# EAGLE design PWR1 (EAGLE 4.16)
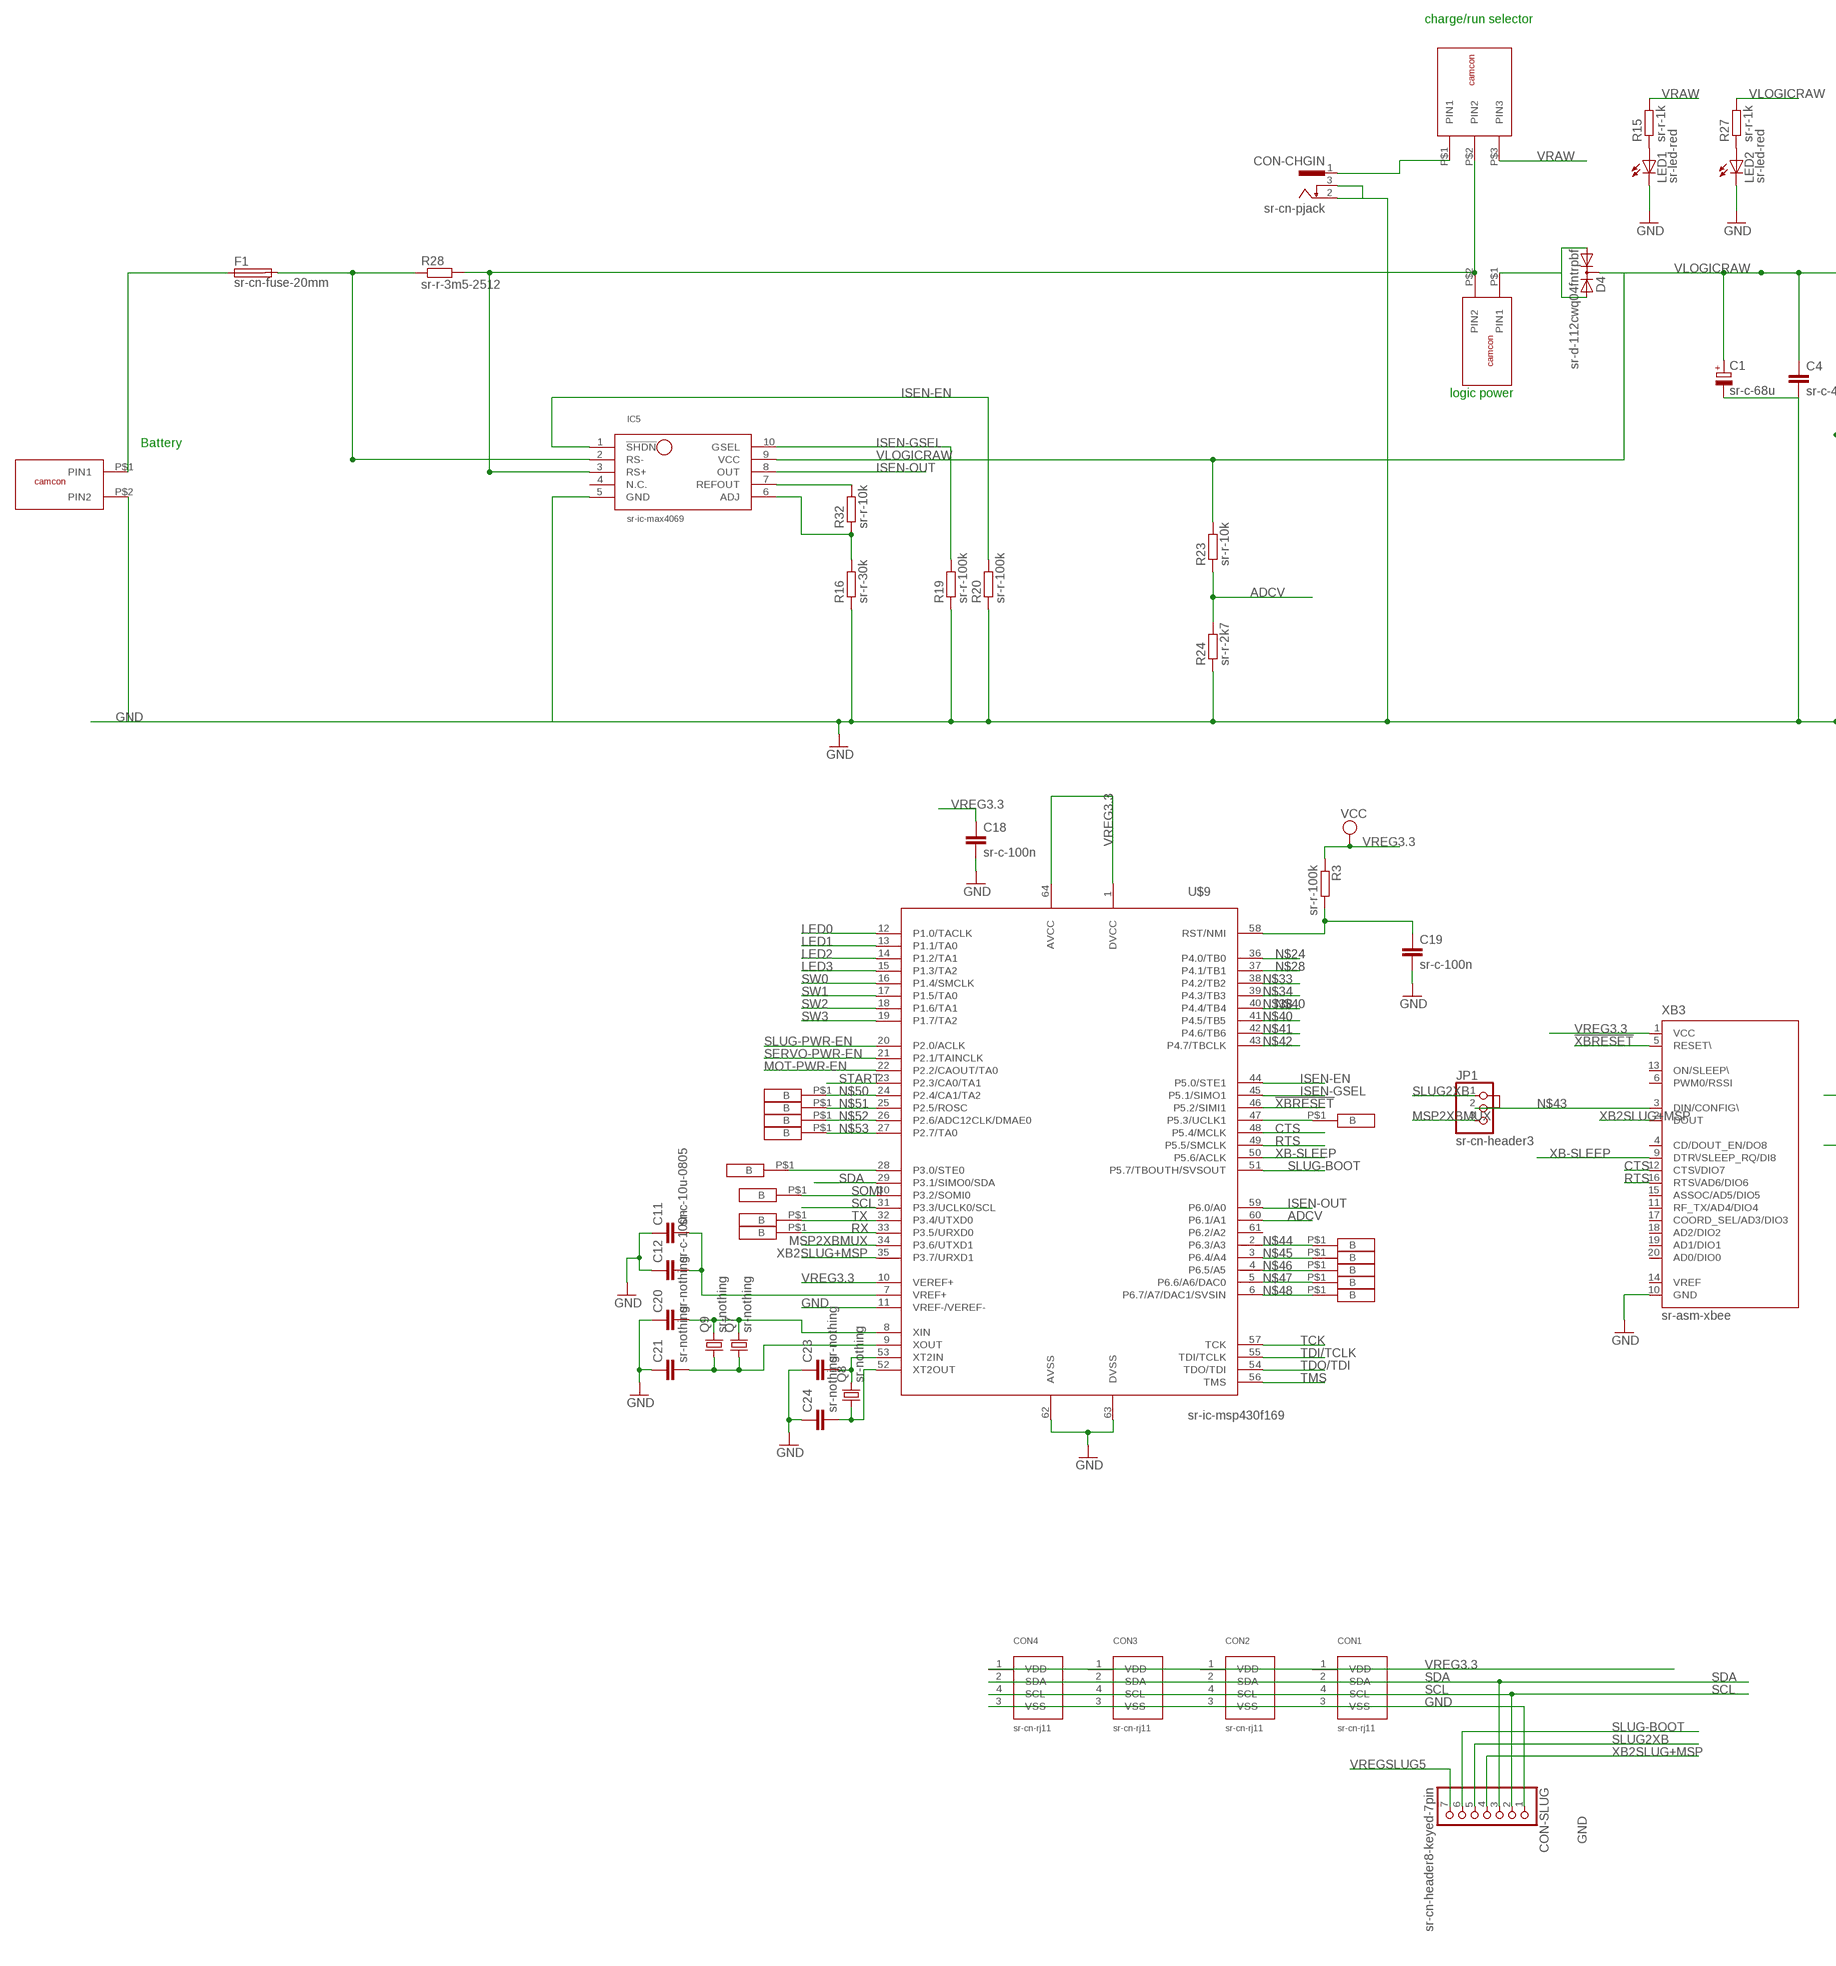
[diagram p0: schematic, sheet 1, part 1 of 2]
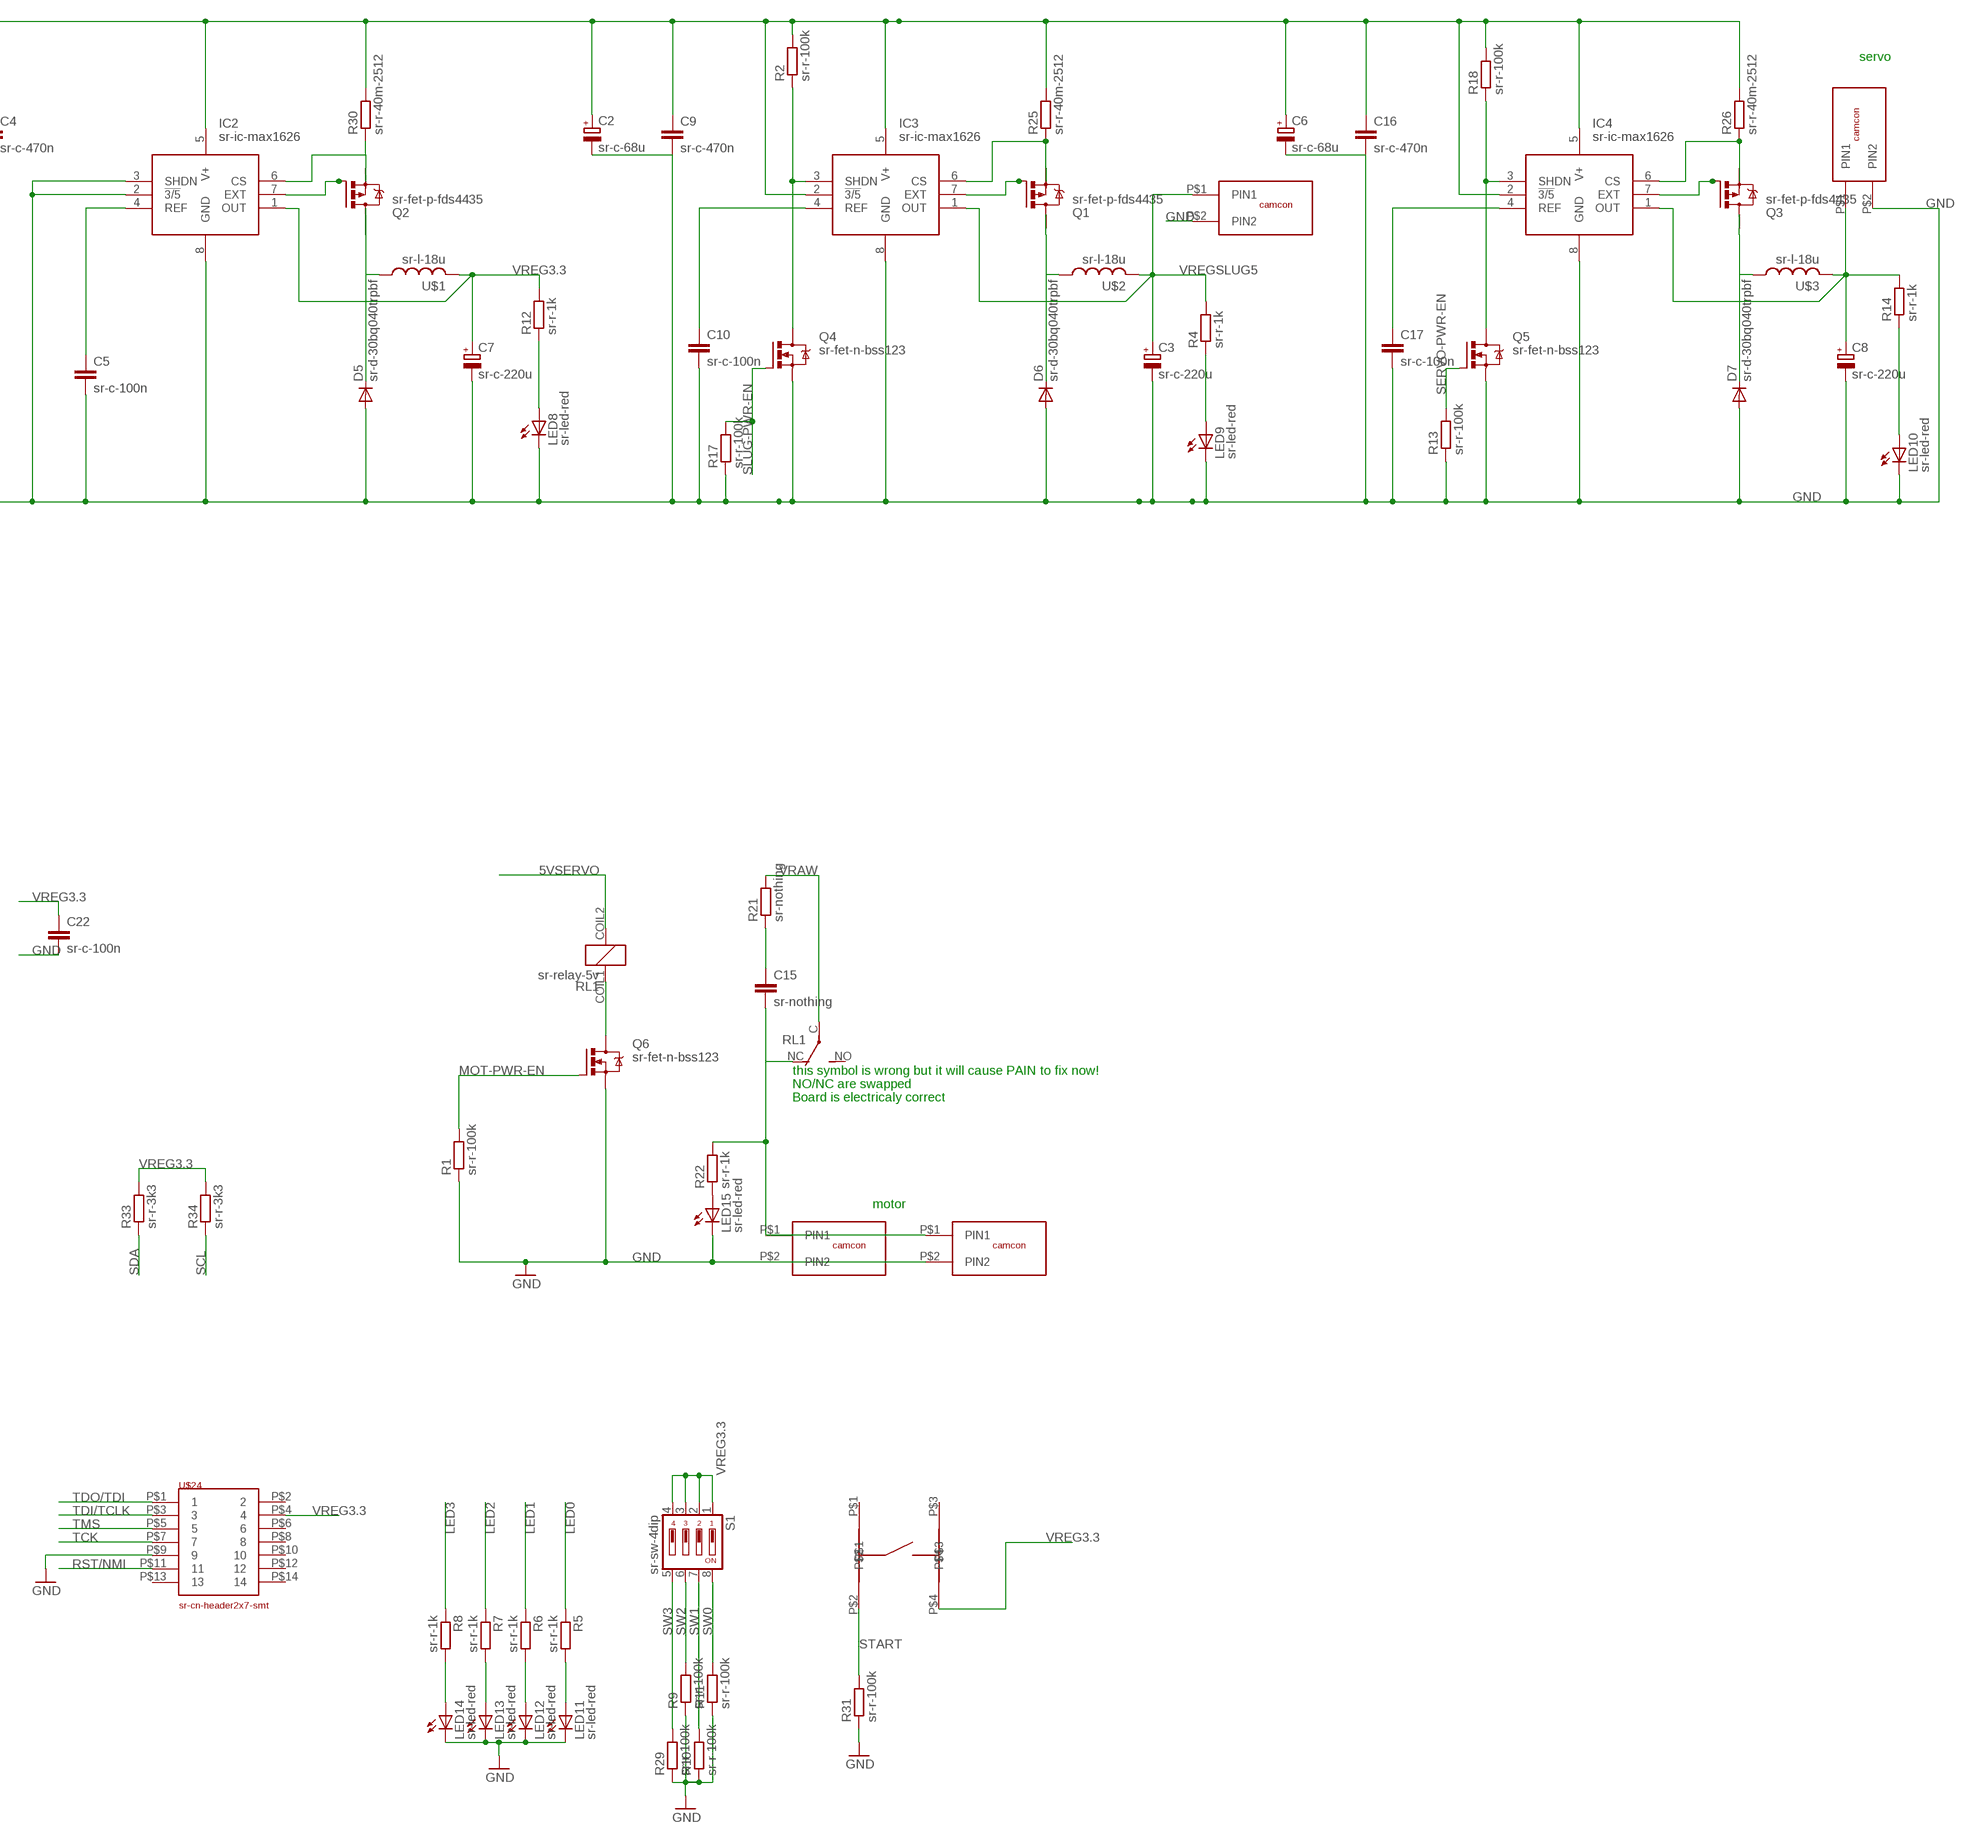
[diagram p1: schematic, sheet 1, part 2 of 2]

## Parts
C1  sr-c-68u  CPOL-EUE  [PANASONIC_E]
C2  sr-c-68u  CPOL-EUE  [PANASONIC_E]
C3  sr-c-220u  CPOL-EUE  [PANASONIC_E]
C4  sr-c-470n  C-EUC0603  [C0603]
C5  sr-c-100n  C-EUC0603  [C0603]
C6  sr-c-68u  CPOL-EUE  [PANASONIC_E]
C7  sr-c-220u  CPOL-EUE  [PANASONIC_E]
C8  sr-c-220u  CPOL-EUE  [PANASONIC_E]
C9  sr-c-470n  C-EUC0603  [C0603]
C10  sr-c-100n  C-EUC0603  [C0603]
C11  sr-c-10u-0805  C-EUC0805  [C0805]
C12  sr-c-100n  C-EUC0603  [C0603]
C15  sr-nothing  C-EUC0603  [C0603]
C16  sr-c-470n  C-EUC0603  [C0603]
C17  sr-c-100n  C-EUC0603  [C0603]
C18  sr-c-100n  C-EUC0603  [C0603]
C19  sr-c-100n  C-EUC0603  [C0603]
C20  sr-nothing  C-EUC0603  [C0603]
C21  sr-nothing  C-EUC0603  [C0603]
C22  sr-c-100n  C-EUC0603  [C0603]
C23  sr-nothing  C-EUC0603  [C0603]
C24  sr-nothing  C-EUC0603  [C0603]
CON1  sr-cn-rj11  MODULE_CON  [RJ11-4P4C]
CON2  sr-cn-rj11  MODULE_CON  [RJ11-4P4C]
CON3  sr-cn-rj11  MODULE_CON  [RJ11-4P4C]
CON4  sr-cn-rj11  MODULE_CON  [RJ11-4P4C]
CON-CHGIN  sr-cn-pjack  SCD-014A  [SCD-014-A]
CON-SLUG  sr-cn-header8-keyed-7pin  PINHD-1X7  [1X07]
D4  sr-d-112cwq04fntrpbf  FFB20UP20DN-DIODE  [TO252-3]
D5  sr-d-30bq040trpbf  DIODE-SMC  [SMC]
D6  sr-d-30bq040trpbf  DIODE-SMC  [SMC]
D7  sr-d-30bq040trpbf  DIODE-SMC  [SMC]
F1  sr-cn-fuse-20mm  SH22,5  [SH22,5]
IC2  sr-ic-max1626  MAX1626ESA+  [SO04]
IC3  sr-ic-max1626  MAX1626ESA+  [SO04]
IC4  sr-ic-max1626  MAX1626ESA+  [SO04]
IC5  sr-ic-max4069  MAX4069  [UMAX]
JP1  sr-cn-header3  PINHD-1X3  [1X03]
LED1  sr-led-red  LEDCHIP-LED0603  [CHIP-LED0603]
LED2  sr-led-red  LEDCHIP-LED0603  [CHIP-LED0603]
LED8  sr-led-red  LEDCHIP-LED0603  [CHIP-LED0603]
LED9  sr-led-red  LEDCHIP-LED0603  [CHIP-LED0603]
LED10  sr-led-red  LEDCHIP-LED0603  [CHIP-LED0603]
LED11  sr-led-red  LEDCHIP-LED0603  [CHIP-LED0603]
LED12  sr-led-red  LEDCHIP-LED0603  [CHIP-LED0603]
LED13  sr-led-red  LEDCHIP-LED0603  [CHIP-LED0603]
LED14  sr-led-red  LEDCHIP-LED0603  [CHIP-LED0603]
LED15  sr-led-red  LEDCHIP-LED0603  [CHIP-LED0603]
Q1  sr-fet-p-fds4435  P-MOSFET-SO8  [SO-08]
Q2  sr-fet-p-fds4435  P-MOSFET-SO8  [SO-08]
Q3  sr-fet-p-fds4435  P-MOSFET-SO8  [SO-08]
Q4  sr-fet-n-bss123  2N7002  [SOT23]
Q5  sr-fet-n-bss123  2N7002  [SOT23]
Q6  sr-fet-n-bss123  2N7002  [SOT23]
Q7  sr-nothing  CRYSTALSM49  [SM49]
Q8  sr-nothing  CRYSTALSM49  [SM49]
Q9  sr-nothing  CRYSTALTC26H  [TC26H]
R1  sr-r-100k  R-EU_R0603  [R0603]
R2  sr-r-100k  R-EU_R0603  [R0603]
R3  sr-r-100k  R-EU_R0603  [R0603]
R4  sr-r-1k  R-EU_R0603  [R0603]
R5  sr-r-1k  R-EU_R0603  [R0603]
R6  sr-r-1k  R-EU_R0603  [R0603]
R7  sr-r-1k  R-EU_R0603  [R0603]
R8  sr-r-1k  R-EU_R0603  [R0603]
R9  sr-r-100k  R-EU_R0603  [R0603]
R10  sr-r-100k  R-EU_R0603  [R0603]
R11  sr-r-100k  R-EU_R0603  [R0603]
R12  sr-r-1k  R-EU_R0603  [R0603]
R13  sr-r-100k  R-EU_R0603  [R0603]
R14  sr-r-1k  R-EU_R0603  [R0603]
R15  sr-r-1k  R-EU_R0603  [R0603]
R16  sr-r-30k  R-EU_R0603  [R0603]
R17  sr-r-100k  R-EU_R0603  [R0603]
R18  sr-r-100k  R-EU_R0603  [R0603]
R19  sr-r-100k  R-EU_R0603  [R0603]
R20  sr-r-100k  R-EU_R0603  [R0603]
R21  sr-nothing  R-EU_R0603  [R0603]
R22  sr-r-1k  R-EU_R0603  [R0603]
R23  sr-r-10k  R-EU_R0603  [R0603]
R24  sr-r-2k7  R-EU_R0603  [R0603]
R25  sr-r-40m-2512  R-EU_R2512  [R2512]
R26  sr-r-40m-2512  R-EU_R2512  [R2512]
R27  sr-r-1k  R-EU_R0603  [R0603]
R28  sr-r-3m5-2512  R-EU_R2512  [R2512]
R29  sr-r-100k  R-EU_R0603  [R0603]
R30  sr-r-40m-2512  R-EU_R2512  [R2512]
R31  sr-r-100k  R-EU_R0603  [R0603]
R32  sr-r-10k  R-EU_R0603  [R0603]
R33  sr-r-3k3  R-EU_R0603  [R0603]
R34  sr-r-3k3  R-EU_R0603  [R0603]
RL1  sr-relay-5v  SRM-1C-SL-5VDCRELAY  [RELAY5PIN]
S1  sr-sw-4dip  DP04  [DP-04]
U$1  sr-l-18u  09INDUCTOR  [09INDUCTIR]
U$2  sr-l-18u  09INDUCTOR  [09INDUCTIR]
U$3  sr-l-18u  09INDUCTOR  [09INDUCTIR]
U$4  sr-cn-camcon3w  CAMCON3W  [09CON3W]
U$5  sr-cn-camcon2w  CAMCON2W  [09CON2W]
U$6  sr-cn-camcon2w  CAMCON2W  [09CON2W]
U$7  sr-cn-camcon2w  CAMCON2W  [09CON2W]
U$8  sr-cn-camcon2w  CAMCON2W  [09CON2W]
U$9  sr-ic-msp430f169  MSP430F169  [LQFP-64]
U$10  sr-sw-button  09SWITCH  [09SW]
U$11  sr-cn-camcon2w  CAMCON2W  [09CON2W]
U$13  sr-nothing  BODGEPLATE1  [BODGEPLATE]
U$14  sr-nothing  BODGEPLATE1  [BODGEPLATE]
U$16  sr-nothing  BODGEPLATE1  [BODGEPLATE]
U$17  sr-nothing  BODGEPLATE1  [BODGEPLATE]
U$24  sr-cn-header2x7-smt  SMT2X7  [SMT2X7]
U$27  sr-nothing  BODGEPLATE1  [BODGEPLATE]
U$28  sr-nothing  BODGEPLATE1  [BODGEPLATE]
U$29  sr-nothing  BODGEPLATE1  [BODGEPLATE]
U$30  sr-nothing  BODGEPLATE1  [BODGEPLATE]
U$31  sr-nothing  BODGEPLATE1  [BODGEPLATE]
U$32  sr-nothing  BODGEPLATE1  [BODGEPLATE]
U$37  sr-nothing  BODGEPLATE1  [BODGEPLATE]
U$38  sr-nothing  BODGEPLATE1  [BODGEPLATE]
U$39  sr-nothing  BODGEPLATE1  [BODGEPLATE]
U$40  sr-nothing  BODGEPLATE1  [BODGEPLATE]
USBPOWER  sr-cn-camcon2w  CAMCON2W  [09CON2W]
XB3  sr-asm-xbee  XBEE  [XBEE]

## Nets
5VSERVO: C8.+ IC4.1(OUT) R14.2 RL1.COIL2 U$3.P$2 U$7.P$1(PIN1)
!XBRESET: U$9.46(P5.2/SIMI1) XB3.5(RESET\)
ADCV: R23.1 R24.2 U$9.60(P6.1/A1)
CTS: U$9.48(P5.4/MCLK) XB3.12(CTS\/DIO7)
GND: C1.- C2.- C3.- C4.2 C5.2 C6.- C7.- C8.- C9.2 C10.2 C11.1 C12.1 C16.2 C17.2 C18.2 C19.2 C20.1 C21.1 C22.2 C23.1 C24.1 CON1.3(VSS) CON2.3(VSS) CON3.3(VSS) CON4.3(VSS) CON-CHGIN.2 CON-CHGIN.3 CON-SLUG.1 D5.A D6.A D7.A IC2.2(!3/5) IC2.3(SHDN) IC2.8(GND) IC3.8(GND) IC4.8(GND) IC5.5(GND) LED1.C LED2.C LED8.C LED9.C LED10.C LED11.C LED12.C LED13.C LED14.C LED15.C Q4.2(S) Q5.2(S) Q6.2(S) R1.1 R9.1 R10.1 R11.1 R13.1 R16.1 R17.1 R19.1 R20.1 R24.1 R29.1 R31.1 U$5.P$2(PIN2) U$7.P$2(PIN2) U$8.P$2(PIN2) U$9.11(VREF-/VEREF-) U$9.62(AVSS) U$9.63(DVSS) U$11.P$2(PIN2) U$24.P$9 USBPOWER.P$2(PIN2) XB3.10(GND)
ISEN-EN: IC5.1(!SHDN) R20.2 U$9.44(P5.0/STE1)
ISEN-GSEL: IC5.10(GSEL) R19.2 U$9.45(P5.1/SIMO1)
ISEN-OUT: IC5.8(OUT) U$9.59(P6.0/A0)
L2: D7.C Q3.5(D) Q3.6(D) Q3.7(D) Q3.8(D) U$3.P$1
LED0: R5.1 U$9.12(P1.0/TACLK)
LED1: R6.1 U$9.13(P1.1/TA0)
LED2: R7.1 U$9.14(P1.2/TA1)
LED3: R8.1 U$9.15(P1.3/TA2)
MOT-PWR-EN: Q6.1(G) R1.2 U$9.22(P2.2/CAOUT/TA0)
MSP2XBMUX: JP1.3 U$9.34(P3.6/UTXD1)
N$1: LED11.A R5.2
N$2: IC5.3(RS+) R28.2 U$4.P$2(PIN2) U$6.P$2(PIN2)
N$3: Q6.3(D) RL1.COIL1
N$4: LED12.A R6.2
N$5: IC2.6(CS) Q2.1(S) Q2.2(S) Q2.3(S) R30.1
N$6: C5.1 IC2.4(REF)
N$7: C15.1 R21.1
N$8: C17.1 IC4.4(REF)
N$9: C20.2 Q7.2 Q9.2 U$9.8(XIN)
N$10: IC2.7(EXT) Q2.4(G)
N$11: IC4.6(CS) Q3.1(S) Q3.2(S) Q3.3(S) R26.1
N$12: C10.1 IC3.4(REF)
N$13: IC3.6(CS) Q1.1(S) Q1.2(S) Q1.3(S) R25.1
N$14: D4.GATE(A1) D4.SOURCE(A2) U$6.P$1(PIN1)
N$15: IC3.7(EXT) Q1.4(G)
N$16: LED13.A R7.2
N$17: C15.2 R22.2 RL1.NC U$8.P$1(PIN1) U$11.P$1(PIN1)
N$18: C21.2 Q7.1 Q9.1 U$9.9(XOUT)
N$19: C23.2 Q8.2 U$9.53(XT2IN)
N$20: IC4.7(EXT) Q3.4(G)
N$21: LED14.A R8.2
N$22: D5.C Q2.5(D) Q2.6(D) Q2.7(D) Q2.8(D) U$1.P$1
N$23: D6.C Q1.5(D) Q1.6(D) Q1.7(D) Q1.8(D) U$2.P$1
N$24: U$9.36(P4.0/TB0)
N$25: LED15.A R22.1
N$26: C11.2 C12.2 U$9.7(VREF+)
N$27: LED1.A R15.1
N$28: U$9.37(P4.1/TB1)
N$29: IC3.3(SHDN) Q4.3(D) R2.1
N$30: LED8.A R12.1
N$31: LED9.A R4.1
N$33: U$9.38(P4.2/TB2)
N$34: U$9.39(P4.3/TB3)
N$35: F1.1 U$5.P$1(PIN1)
N$36: IC4.3(SHDN) Q5.3(D) R18.1
N$37: LED10.A R14.1
N$38: U$9.40(P4.4/TB4)
N$39: F1.2 IC5.2(RS-) R28.1
N$40: U$9.41(P4.5/TB5)
N$41: U$9.42(P4.6/TB6)
N$42: U$9.43(P4.7/TBCLK)
N$43: JP1.2 XB3.3(DIN/CONFIG\)
N$44: U$9.2(P6.3/A3) U$32.P$1(B)
N$45: U$9.3(P6.4/A4) U$31.P$1(B)
N$46: U$9.4(P6.5/A5) U$30.P$1(B)
N$47: U$9.5(P6.6/A6/DAC0) U$29.P$1(B)
N$48: U$9.6(P6.7/A7/DAC1/SVSIN) U$28.P$1(B)
N$49: U$9.28(P3.0/STE0) U$13.P$1(B)
N$50: U$9.24(P2.4/CA1/TA2) U$37.P$1(B)
N$51: U$9.25(P2.5/ROSC) U$38.P$1(B)
N$52: U$9.26(P2.6/ADC12CLK/DMAE0) U$39.P$1(B)
N$53: U$9.27(P2.7/TA0) U$40.P$1(B)
N$54: CON-CHGIN.1 U$4.P$1(PIN1)
N$55: U$9.47(P5.3/UCLK1) U$27.P$1(B)
N$56: IC5.7(REFOUT) R32.2
N$58: IC5.6(ADJ) R16.2 R32.1
N$68: LED2.A R27.1
N$70: C24.2 Q8.1 U$9.52(XT2OUT)
RST/NMI: C19.1 R3.2 U$9.58(RST/NMI) U$24.P$11
RTS: U$9.49(P5.5/SMCLK) XB3.16(RTS\/AD6/DIO6)
RX: U$9.33(P3.5/URXD0) U$17.P$1(B)
SCL: CON1.4(SCL) CON2.4(SCL) CON3.4(SCL) CON4.4(SCL) CON-SLUG.2 R34.1 U$9.31(P3.3/UCLK0/SCL)
SDA: CON1.2(SDA) CON2.2(SDA) CON3.2(SDA) CON4.2(SDA) CON-SLUG.3 R33.1 U$9.29(P3.1/SIMO0/SDA)
SERVO-PWR-EN: Q5.1(G) R13.2 U$9.21(P2.1/TAINCLK)
SLUG2XB: CON-SLUG.5 JP1.1
SLUG-BOOT: CON-SLUG.6 U$9.51(P5.7/TBOUTH/SVSOUT)
SLUG-PWR-EN: Q4.1(G) R17.2 U$9.20(P2.0/ACLK)
SOMI: U$9.30(P3.2/SOMI0) U$14.P$1(B)
START: R31.2 U$9.23(P2.3/CA0/TA1) U$10.P$2
SW0: R11.2 S1.8 U$9.16(P1.4/SMCLK)
SW1: R10.2 S1.7 U$9.17(P1.5/TA0)
SW2: R9.2 S1.6 U$9.18(P1.6/TA1)
SW3: R29.2 S1.5 U$9.19(P1.7/TA2)
TCK: U$9.57(TCK) U$24.P$7
TDI/TCLK: U$9.55(TDI/TCLK) U$24.P$3
TDO/TDI: U$9.54(TDO/TDI) U$24.P$1
TMS: U$9.56(TMS) U$24.P$5
TX: U$9.32(P3.4/UTXD0) U$16.P$1(B)
VLOGICRAW: C1.+ C2.+ C4.1 C6.+ C9.1 C16.1 D4.DRAIN(C) IC2.5(V+) IC3.2(!3/5) IC3.5(V+) IC4.2(!3/5) IC4.5(V+) IC5.9(VCC) R2.2 R18.2 R23.2 R25.2 R26.2 R27.2 R30.2
VRAW: R15.2 R21.2 RL1.C U$4.P$3(PIN3)
VREG3.3: C7.+ C18.1 C22.1 CON1.1(VDD) CON2.1(VDD) CON3.1(VDD) CON4.1(VDD) IC2.1(OUT) R3.1 R12.2 R33.2 R34.2 S1.1 S1.2 S1.3 S1.4 U$1.P$2 U$9.1(DVCC) U$9.10(VEREF+) U$9.64(AVCC) U$10.P$4 U$24.P$4 XB3.1(VCC) ; supply symbol labelled VCC
VREGSLUG5: C3.+ CON-SLUG.7 IC3.1(OUT) R4.2 U$2.P$2 USBPOWER.P$1(PIN1)
XB2SLUG+MSP: CON-SLUG.4 U$9.35(P3.7/URXD1) XB3.2(DOUT)
XB-SLEEP: U$9.50(P5.6/ACLK) XB3.9(DTR\/SLEEP_RQ/DI8)
Unconnected: RL1.NO U$9.61(P6.2/A2) U$10.P$1 U$10.P$3 U$24.P$2 U$24.P$6 U$24.P$8 U$24.P$10 U$24.P$12 U$24.P$13 U$24.P$14 XB3.4(CD/DOUT_EN/DO8) XB3.6(PWM0/RSSI) XB3.11(RF_TX/AD4/DIO4) XB3.13(ON/SLEEP\) XB3.14(VREF) XB3.15(ASSOC/AD5/DIO5) XB3.17(COORD_SEL/AD3/DIO3) XB3.18(AD2/DIO2) XB3.19(AD1/DIO1) XB3.20(AD0/DIO0)

## Notes on the sheet
- charge/run selector
- servo
- logic power
- Battery
- this symbol is wrong but it will cause PAIN to fix now!
- NO/NC are swapped
- Board is electricaly correct
- motor

## Power pins joined to a net without a drawn wire
N.C.: IC5.4(N.C.)

## Library data of the parts
C1-C3 C6-C8 = rcl:CPOL-EU: POLARIZED CAPACITOR, European symbol
C4 C5 C9-C12 C15-C24 = rcl:C-EU: CAPACITOR, European symbol
CON1-CON4 = ecssr:MODULE_CON
CON-CHGIN = con-shiua-chyuan:SCD-014A: Power Jack 2.5mm
CON-SLUG = pinhead:PINHD-1X7: PIN HEADER
D4 = ecssr-Pwr:FFB20UP20DN-DIODE
D5-D7 = diode:DIODE-: DIODE
F1 = fuse:SH22,5: FUSE HOLDER grid 22,5 mm, OGN0031 8201, Schurter (Buerklin)
IC2-IC4 = ecssr-Pwr:MAX1626ESA+
IC5 = ecssr-Pwr:MAX4069
JP1 = ecssr-Pwr:PINHD-1X3: PIN HEADER
LED1 LED2 LED8-LED15 = led:LED: LED OSRAM: - CHIPLED LG R971, LG N971, LY N971, LG Q971, LY Q971, LO R971, LY R971 LH N974, LH R974 LS Q976, LO Q976, LY Q976 LO Q996 - Hyper CHIPLED LW Q18S LB Q993, LB Q99A, LB R99A - SideLED LS A670, LO A670, LY A670, LG A670, LP A670 LB A673, LV A673, LT A673, LW A673 LH A674 LY A675 LS A676, LA A676, LO A676, LY A676, LW A676 LS A679, LY A679, LG A679 - Hyper Micro SIDELED® LS Y876, LA Y876, LO Y876, LY Y876 LT Y87S - SmartLED LW L88C, LW L88S LB L89C, LB L89S, LG L890 LS L89K, LO L89K, LY L89K LS L896, LA L896, LO L896, LY L896 - TOPLED LS T670, LO T670, LY T670, LG T670, LP T670 LSG T670, LSP T670, LSY T670, LOP T670, LYG T670 LG T671, LOG T671, LSG T671 LB T673, LV T673, LT T673, LW T673 LH T674 LS T676, LA T676, LO T676, LY T676, LB T676, LH T676, LSB T676, LW T676 LB T67C, LV T67C, LT T67C, LS T67K, LO T67K, LY T67K, LW E67C LS E67B, LA E67B, LO E67B, LY E67B, LB E67C, LV E67C, LT E67C LW T67C LS T679, LY T679, LG T679 LS T770, LO T770, LY T770, LG T770, LP T770 LB T773, LV T773, LT T773, LW T773 LH T774 LS E675, LA E675, LY E675, LS T675 LS T776, LA T776, LO T776, LY T776, LB T776 LHGB T686 LT T68C, LB T68C - Hyper Mini TOPLED® LB M676 - Mini TOPLED Santana® LG M470 LS M47K, LO M47K, LY M47K Source: http://www.osram.convergy.de - LUMILED® LXK2-PW12-R00, LXK2-PW12-S00, LXK2-PW14-U00, LXK2-PW14-V00 LXK2-PM12-R00, LXK2-PM12-S00, LXK2-PM14-U00 LXK2-PE12-Q00, LXK2-PE12-R00, LXK2-PE12-S00, LXK2-PE14-T00, LXK2-PE14-U00 LXK2-PB12-K00, LXK2-PB12-L00, LXK2-PB12-M00, LXK2-PB14-N00, LXK2-PB14-P00, LXK2-PB14-Q00 LXK2-PR12-L00, LXK2-PR12-M00, LXK2-PR14-Q00, LXK2-PR14-R00 LXK2-PD12-Q00, LXK2-PD12-R00, LXK2-PD12-S00 LXK2-PH12-R00, LXK2-PH12-S00 LXK2-PL12-P00, LXK2-PL12-Q00, LXK2-PL12-R00 Source: www.luxeon.com
Q1-Q3 = transistor-power:P-MOSFET-SO8: P-Channel MOSFET Example: FDS4435A; P-Channel Logic Level PowerTrench® MOSFET FDS4465; P-Channel 1.8V Specified PowerTrench® MOSFET Source: www.fairchildsemi.com
Q4-Q6 = ecssr:2N7002
Q7-Q9 = crystal:CRYSTAL: CRYSTAL
R1-R34 = rcl:R-EU_: RESISTOR, European symbol
RL1 = ecssr-Pwr:SRM-1C-SL-5VDCRELAY
S1 = switch-dil:DP04: DIL/CODE SWITCH
U$1-U$3 = ecssr-Pwr:09INDUCTOR
U$4 = ecssr-Pwr:CAMCON3W
U$5-U$8 U$11 USBPOWER = ecssr-Pwr:CAMCON2W
U$9 = gumsense:MSP430F169
U$10 = ecssr-Pwr:09SWITCH
U$13 U$14 U$16 U$17 U$27-U$32 U$37-U$40 = w2b:BODGEPLATE1
U$24 = w2b:SMT2X7
XB3 = ecssr-Pwr:XBEE: XBee (TM) /XBee-PRO(TM) OEM RF Modules Source: MaxStream, Inc. xbee_productmanual.pdf

## Board
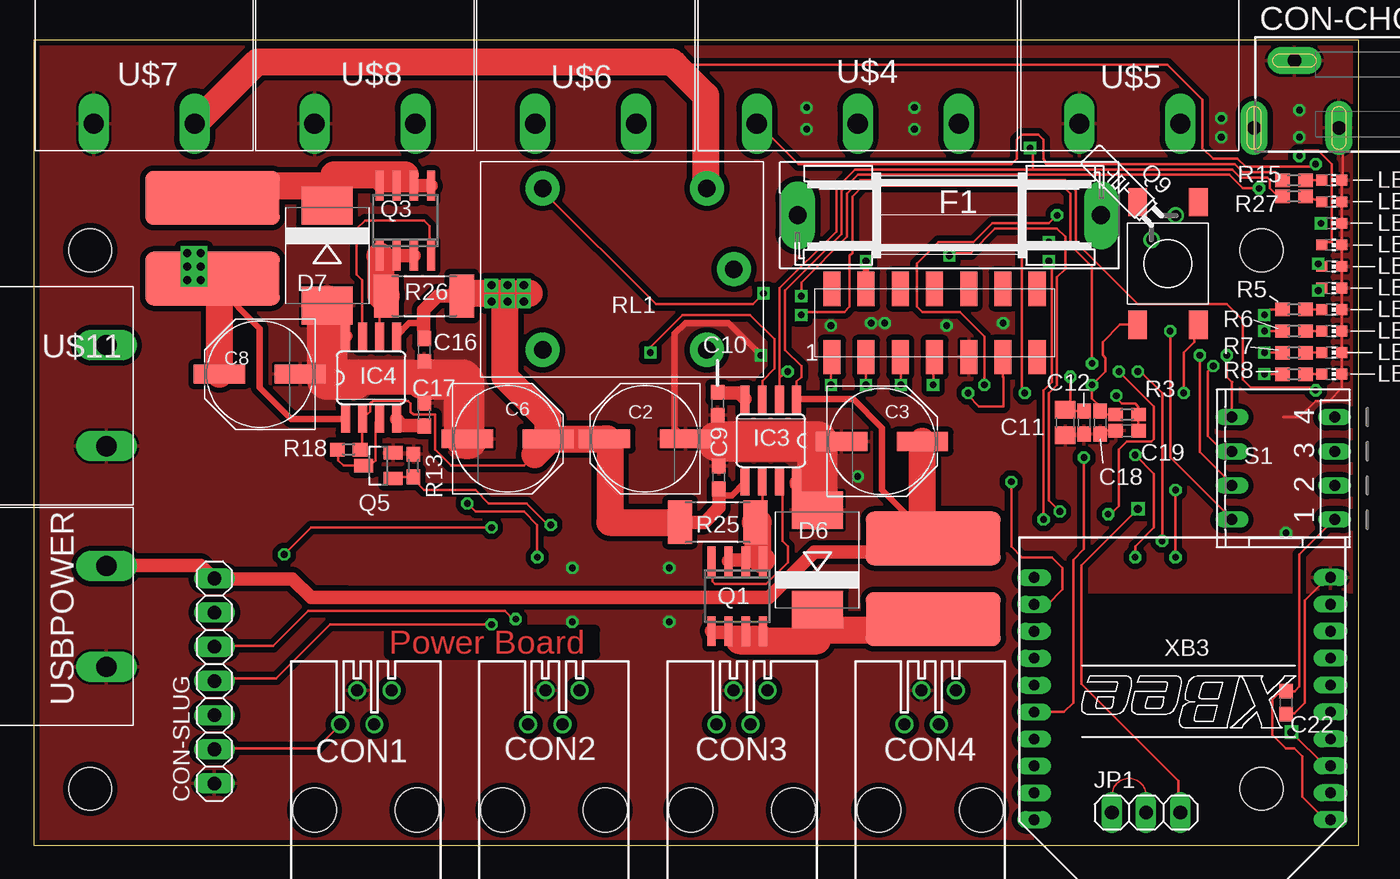
[diagram p2: board, top side]
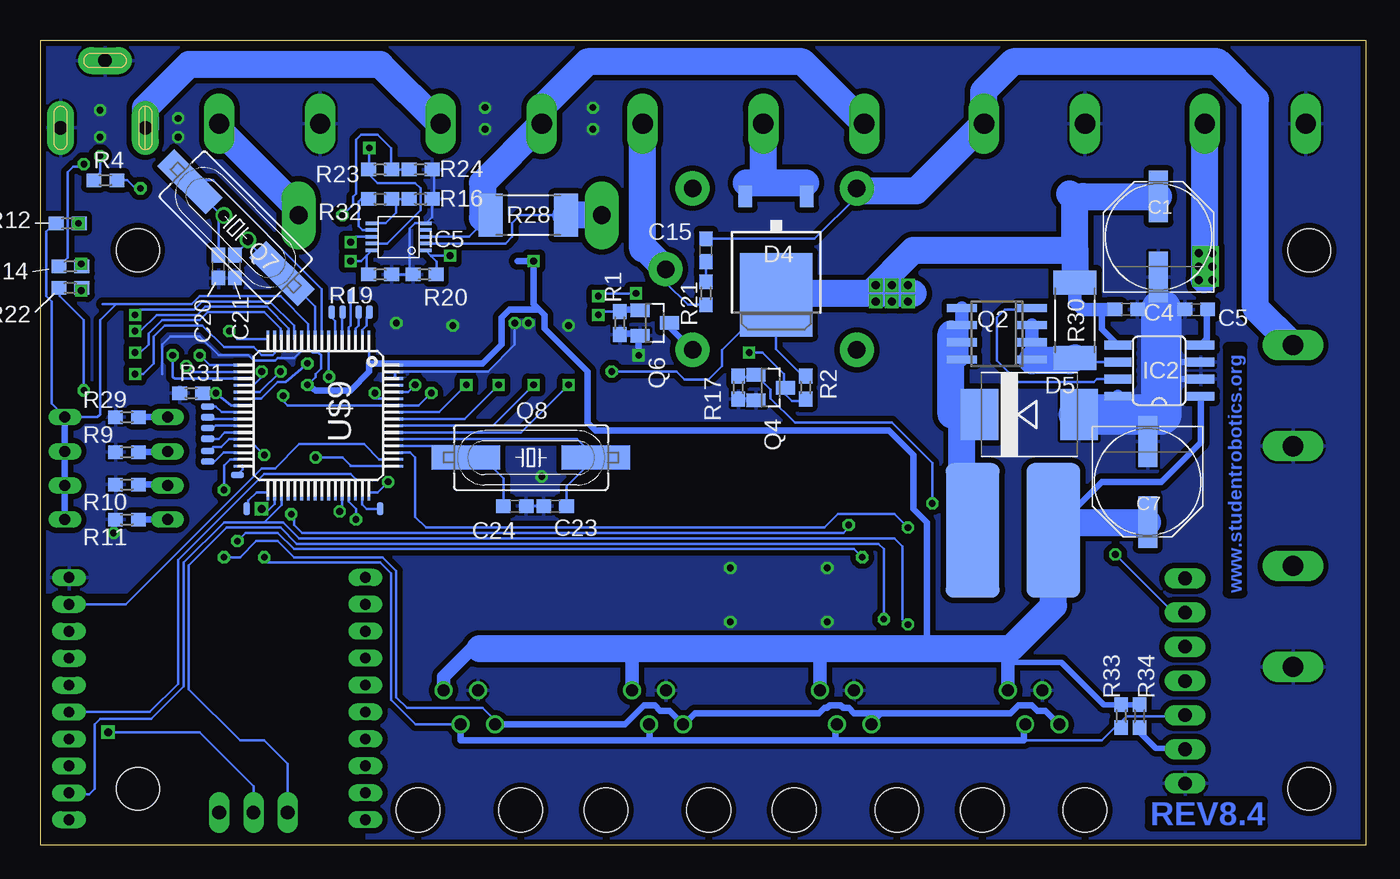
[diagram p3: board, bottom side, seen from below]

Size 98.4 x 59.8 mm. Coordinates in mm from the lower left corner, seen from the top.
Outline: 0,0 98.4,0 98.4,59.8 0,59.8 0,0
Copper layers (1*16): Top 0.035mm / dielectric 1.5mm / Bottom 0.035mm
Design rules "default": minimum track width 0.2mm, minimum drill 0.5mm, track to track 0.2mm, track to pad 0.2mm, pad to pad 0.2mm, via to via 0.2mm, smd to smd 0mil, copper to edge 0.2mm, drill to drill 0.2mm, minimum pad ring 0.2mm, minimum via ring 0.2mm, stop-mask expansion 0mil, vias tented up to drill 0mil, thermal gap 0.2mm
Holes 3.2 mm at 91.2,44.2 91.2,4.2 4.2,44.2 4.2,4.2

### Footprints (pad centres in the part's own frame; a part is rotated, then mirrored left to right if it is on the bottom)
PANASONIC_E = smd 3.8 x 1.4: + 3,0; - -3,0
C0603 = smd 1.1 x 1: 1 -0.85,0; 2 0.85,0
C0805 = smd 1.3 x 1.5: 1 -0.95,0; 2 0.95,0
RJ11-4P4C = drill 0.889 round: 1 1.905,8.89; 2 0.635,6.35; 3 -0.635,8.89; 4 -1.905,6.35 | hole 3.251: -3.81,0; 3.81,0
SCD-014-A = drill 1 pad 2 long: 1 -2.5,13.8; 2 -2.5,7.5; 3 2.5,10.8
1X07 = drill 1.016 long: 1 -7.62,0; 2 -5.08,0; 3 -2.54,0; 4 0,0; 5 2.54,0; 6 5.08,0; 7 7.62,0
TO252-3 = smd 5.4 x 6.2: DRAIN 0.12,1.58 | smd 1 x 1.6: GATE -2.16,-5.72; SOURCE 2.4,-5.72
SMC = smd 2.8 x 3.8: A 3.7,0; C -3.7,0
SH22,5 = drill 1.321 pad 2.54 long: 1 -11.252,0; 2 11.252,0
SO04 = smd 0.66 x 2.032: 1 -4.445,-0.533; 2 -3.175,-0.533; 3 -1.905,-0.533; 4 -0.635,-0.533; 5 -0.635,5.613; 6 -1.905,5.613; 7 -3.175,5.613; 8 -4.445,5.613
UMAX = smd 0.94 x 0.254: 1 -1.358,0.193; 2 -1.358,-0.307; 3 -1.358,-0.808; 4 -1.358,-1.308; 5 -1.358,-1.808; 6 2.616,-1.808; 7 2.616,-1.308; 8 2.616,-0.808; 9 2.616,-0.307; 10 2.616,0.193
1X03 = drill 1.016 long: 1 -2.54,0; 2 0,0; 3 2.54,0
CHIP-LED0603 = smd 0.8 x 0.8: A 0,-0.75; C 0,0.75
SO-08 = smd 0.6 x 2.2: 1 -1.905,-2.6; 2 -0.635,-2.6; 3 0.635,-2.6; 4 1.905,-2.6; 5 1.905,2.6; 6 0.635,2.6; 7 -0.635,2.6; 8 -1.905,2.6
SOT23 = smd 1 x 1.4: 1 -0.95,-1.1; 2 0.95,-1.1; 3 0,1.1
SM49 = smd 5.08 x 1.778: 1 -4.826,0; 2 4.826,0
TC26H = drill 0.813 round: 1 -1.27,0; 2 1.27,0
R0603 = smd 1.1 x 1: 1 -0.85,0; 2 0.85,0
R2512 = smd 1.8 x 3.2: 1 -2.8,0; 2 2.8,0
RELAY5PIN = drill 1.3 pad 2.54 round: C -2,0; COIL1 0,6; COIL2 0,-6; NC 12.2,-6; NO 12.2,6
DP-04 = drill 0.813 long: 1 -3.81,-3.81; 2 -1.27,-3.81; 3 1.27,-3.81; 4 3.81,-3.81; 5 3.81,3.81; 6 1.27,3.81; 7 -1.27,3.81; 8 -3.81,3.81
09INDUCTIR = smd 10 x 4: P$1 0,3; P$2 0,-3
09CON3W = drill 1.5 long: P$1 -7.5,0; P$2 0,0; P$3 7.5,0
09CON2W = drill 1.5 long: P$1 -3.75,0; P$2 3.75,0
LQFP-64 = smd 1.2 x 0.2: 1 -0.62,-1.33; 2 -0.62,-1.83; 3 -0.62,-2.33; 4 -0.62,-2.83; 5 -0.62,-3.33; 6 -0.62,-3.83; 7 -0.62,-4.33; 8 -0.62,-4.83; 9 -0.62,-5.33; 10 -0.62,-5.83; 11 -0.62,-6.33; 12 -0.62,-6.83; 13 -0.62,-7.33; 14 -0.62,-7.83; 15 -0.62,-8.33; 16 -0.62,-8.83; 33 10.78,-8.83; 34 10.78,-8.33; 35 10.78,-7.83; 36 10.78,-7.33; 37 10.78,-6.83; 38 10.78,-6.33; 39 10.78,-5.83; 40 10.78,-5.33; 41 10.78,-4.83; 42 10.78,-4.33; 43 10.78,-3.83; 44 10.78,-3.33; 45 10.78,-2.83; 46 10.78,-2.33; 47 10.78,-1.83; 48 10.78,-1.33 | smd 0.2 x 1.2: 17 1.33,-10.78; 18 1.83,-10.78; 19 2.33,-10.78; 20 2.83,-10.78; 21 3.33,-10.78; 22 3.83,-10.78; 23 4.33,-10.78; 24 4.83,-10.78; 25 5.33,-10.78; 26 5.83,-10.78; 27 6.33,-10.78; 28 6.83,-10.78; 29 7.33,-10.78; 30 7.83,-10.78; 31 8.33,-10.78; 32 8.83,-10.78; 49 8.83,0.62; 50 8.33,0.62; 51 7.83,0.62; 52 7.33,0.62; 53 6.83,0.62; 54 6.33,0.62; 55 5.83,0.62; 56 5.33,0.62; 57 4.83,0.62; 58 4.33,0.62; 59 3.83,0.62; 60 3.33,0.62; 61 2.83,0.62; 62 2.33,0.62; 63 1.83,0.62; 64 1.33,0.62
09SW = smd 1.4 x 2.1: P$1 2.25,4.55; P$2 2.25,-4.55; P$3 -2.25,4.55; P$4 -2.25,-4.55
BODGEPLATE = smd 0.5 x 1: P$1 0,0
SMT2X7 = smd 1.27 x 2.54: P$1 -7.62,-2.54; P$2 -7.62,2.54; P$3 -5.08,-2.54; P$4 -5.08,2.54; P$5 -2.54,-2.54; P$6 -2.54,2.54; P$7 0,-2.54; P$8 0,2.54; P$9 2.54,-2.54; P$10 2.54,2.54; P$11 5.08,-2.54; P$12 5.08,2.54; P$13 7.62,-2.54; P$14 7.62,2.54
XBEE = drill 0.8 pad 1.27 long: 1 -11,9; 2 -11,7; 3 -11,5; 4 -11,3; 5 -11,1; 6 -11,-1; 7 -11,-3; 8 -11,-5; 9 -11,-7; 10 -11,-9; 11 11,-9; 12 11,-7; 13 11,-5; 14 11,-3; 15 11,-1; 16 11,1; 17 11,3; 18 11,5; 19 11,7; 20 11,9

### Placement (x,y rotation side)
C1  15.4,45.2 90 bottom
C2  45.4,30.2 180 top
C3  63,30 0 top
C4  17.8,39.8 0 bottom
C5  12.6,39.8 180 bottom
C6  35.2,30.2 0 top
C7  16.2,27 270 bottom
C8  16.8,35 180 top
C9  50.88,27.33 90 top
C10  50.8,32.8 270 top
C11  76.6,31.4 90 top
C12  78,31.4 90 top
C15  49,44.2 90 bottom
C16  29,36.8 270 top
C17  29,32 90 top
C18  79.2,31.4 270 top
C19  81.2,30.8 180 top
C20  85.2,43 90 bottom
C21  84,43 90 bottom
C22  93,10.6 270 top
C23  60.2,25.2 0 bottom
C24  63.2,25.2 180 bottom
CON1  24.66,2.62 0 top
CON2  38.63,2.62 0 top
CON3  52.6,2.62 0 top
CON4  66.58,2.62 0 top
CON-CHGIN  104.43,55.79 90 top
CON-SLUG  13.42,12.21 90 top
D4  43.67,42.48 180 bottom
D5  25,32 0 bottom
D6  58.2,21.2 90 top
D7  21.8,43.8 270 top
F1  68,46.8 180 top
IC2  12.8,37.8 90 bottom
IC3  52.2,32.6 180 top
IC4  27.6,32.2 0 top
IC5  71.19,44.4 180 bottom
JP1  82.61,2.43 0 top
LED1  96.4,49.4 270 top
LED2  96.4,47.8 270 top
LED8  96.4,46.2 270 top
LED9  96.4,44.6 270 top
LED10  96.4,43 270 top
LED11  96.4,39.8 270 top
LED12  96.4,38.2 270 top
LED13  96.4,36.6 270 top
LED14  96.4,35 270 top
LED15  96.4,41.4 270 top
Q1  52.25,18.51 180 top
Q2  27.4,38 90 bottom
Q3  27.6,46.4 0 top
Q4  44.2,34 270 bottom
Q5  25.6,28.2 90 top
Q6  52.8,38.8 270 bottom
Q7  83.92,45.88 135 bottom
Q8  62,28.8 0 bottom
Q9  83.92,45.88 45 top
R1  55.4,38.8 90 bottom
R2  41.6,34 90 bottom
R3  81.2,32 0 top
R4  93.6,49.4 0 bottom
R5  93.6,39.8 0 top
R6  93.6,38.2 0 top
R7  93.6,36.6 0 top
R8  93.6,35 0 top
R9  92,29.2 0 bottom
R10  92,26.8 0 bottom
R11  92,24.2 0 bottom
R12  96.4,46.2 180 bottom
R13  28.2,28.2 270 top
R14  96.2,43 180 bottom
R15  93.6,49.4 180 top
R16  70.2,48 180 bottom
R17  46.6,34 90 bottom
R18  23.4,29.4 0 top
R19  73.2,42.4 180 bottom
R20  69.9,42.4 0 bottom
R21  49,41 270 bottom
R22  96.2,41.4 180 bottom
R23  73.2,50.2 180 bottom
R24  70.2,50.2 180 bottom
R25  50.8,24 180 top
R26  29,40.8 0 top
R27  93.6,48.2 180 top
R28  62.2,46.8 180 bottom
R29  92,31.8 0 bottom
R30  21.6,39 90 bottom
R31  87.23,33.59 0 bottom
R32  73.2,48 180 bottom
R33  18.17,9.6 90 bottom
R34  16.8,9.6 90 bottom
RL1  50,42.8 180 top
S1  92.8,28 90 top
U$1  26.2,23.4 90 bottom
U$2  66.8,19.8 180 top
U$3  13.28,45.09 0 top
U$4  61.2,53.6 180 top
U$5  81.4,53.6 180 top
U$6  41,53.6 180 top
U$7  8.2,53.6 180 top
U$8  24.6,53.6 180 top
U$9  72.7,37 270 bottom
U$10  84.23,43.22 0 top
U$11  5.4,33.4 270 top
U$13  86,29.3 90 bottom
U$14  86,28.5 90 bottom
U$16  83.8,27.5 90 bottom
U$17  83.1,25 0 bottom
U$24  66.9,38.8 0 top
U$27  73.2,25 0 bottom
U$28  76.8,39.6 0 bottom
U$29  76,39.6 0 bottom
U$30  75.4,40.8 0 bottom
U$31  74.8,39.6 0 bottom
U$32  74,39.6 0 bottom
U$37  86,32.6 90 bottom
U$38  86,31.8 90 bottom
U$39  86,31 90 bottom
U$40  86,30.2 90 bottom
USBPOWER  5.4,17 270 top
XB3  85.3,10.9 180 top

### Tracks (layer width: path | path; a pad name or v marks a point on that pad's centre or on a via)
5VSERVO  (via drill 0.5, 0.6)
  Top 0.2: 47.6,58 84.2,58 86.8,55.4 86.8,51.8 87.6,51 89.4,51 90,50.4 94.8,50.4 95.2,50.8 v95.2,50.6 | v11.4,44 v11.4,43 11.4,42.2 11.2,42 v11.4,42 v12.4,42 | 12.49,42.09 12.49,42.91 v12.4,43 v12.4,44
  Top 0.5: IC4.1 19.13,31.67 16.8,34 16.8,38.4 13.6,41.6 | U$3.P$2 12.49,42.09 v12.4,42
  Top 2: 13.11,42.09 13,42.2 | 13.11,42.09 U$3.P$2 | C8.+ 13.8,41.4 13.6,41.6 13.11,42.09 | U$7.P$1 12,53.6 16.6,58.2 47.4,58.2 47.6,58 49.9,55.7 49.9,49 50,49 RL1.COIL2
  Bottom 0.2: R14.2 96.4,43.65 96.4,50 96,50.4 95.4,50.4 v95.2,50.6
  Bottom 0.5: v12.4,42 12,42
  Bottom 2: U$7.P$1 11.95,42.05 12,42
!XBRESET
  Bottom 0.2: U$9.46 75.03,27.23 75.4,27.6 81.8,27.6 88.2,21.2 88.2,12 90.3,9.9 XB3.5
ADCV  (via drill 0.5)
  Top 0.2: v70.6,34.2 70.6,37.8 68.8,39.6 66,39.6 65.6,40 65.6,43.2 67.2,44.8 69.8,44.8 71.2,46.2 75.4,46.2 v76,46.8
  Bottom 0.2: 71,50.2 R24.2 R23.1 72.4,50.2 72.4,51.8 73.4,52.8 74.6,52.8 75,52.4 75,48.4 75.2,48.2 75.2,47.6 v76,46.8 | U$9.60 71.13,33.67 v70.6,34.2
CTS  (via drill 0.5)
  Top 0.2: XB3.12 75.3,17.9 76.4,19 76.4,20.6 75.6,21.4 73.4,21.4 72.6,22.2 v72.6,27
  Bottom 0.2: 73.82,26.22 U$9.48 74.01,26.2 73.4,26.2 v72.6,27
GND  (via drill 0.5)
  Top 0.2: C18.2 79.35,30.55 79.6,30.8 C19.2 | C2.- 50.6,30.2 50.8,30 | LED9.C 97.15,44.45 97.2,44.4 | LED9.C LED8.C 97.2,46.2 97.15,46.25 LED2.C 97.2,47.8 97.15,47.85 LED1.C 97.2,49.4 97.2,53.02 CON-CHGIN.2 | LED9.C 97.15,43.25 97.2,43.2 97.15,43.15 LED10.C 97.15,41.45 97.2,41.4 LED15.C LED11.C | LED11.C 97.15,39.65 97.2,39.6 | LED12.C 97.15,38.05 97.2,38 | LED12.C LED11.C | LED12.C 97.15,36.65 97.2,36.6 LED13.C 97.15,35.05 97.2,35 LED14.C 97.15,33.95 96.2,33 95.2,33 94,31.8 92.8,31.8 | XB3.10 96.2,20 94.4,18.2 94.4,10.6 93.6,9.8 93,9.8 C22.2
  Top 0.5: C2.- 47.6,31 47.6,38 48.4,38.8 51.6,38.8 v54,36.4
  Top 1: C8.- 21.8,35.6 | IC4.8 23.09,37.8 21.8,37.8 | 28.97,34.6 28.97,34.8 C16.2 | 28.97,34.6 29,34.6 | C17.2 28.96,34.6 28.97,34.6 | 58.2,30 C3.- | C9.2 50.88,30 50.8,30 C10.2 | IC3.8 56.65,26.8 58.2,26.8
  Top 2.6: 28.98,34.8 29,34.8 | 28.98,34.8 28.97,34.8 | 23.8,34.6 24,34.8 28.98,34.8
  Top 3: D7.A 21.8,37.8 21.8,35.6 21.8,34.6 23.8,34.6 | D6.A 58.2,26.8 58.2,30 50.8,30 | 29,34.6 31.8,34.6 31.98,34.42 31.98,30.4 32.18,30.2
  Bottom 0.2: 71,42.4 R19.1 | R24.1 69.2,50.05 69.2,48 R16.1 69.35,46.65 69.8,46.2 69.81,46.21 IC5.5 70.59,46.21 71,45.8 71,42.4 | R20.1 71,42.4 | D5.A 21.4,32 | R17.1 46.6,33.2 45.45,33.2 Q4.2 | 72.03,35.17 72,35.2 65.2,35.2 63.2,37.2 v63.2,38.8 | 72.03,35.17 U$9.63 | U$9.62 72.08,35.12 72.03,35.17 | 62.4,25.2 C24.1 C23.1 | R29.1 92.8,31.8 93,32 | U$9.11 79.03,36.77 79.6,36.2 80.8,36.2 81,36 82.6,36 83,36.4 85.2,36.4 86.6,37.8 88.8,37.8 89.4,37.2 89.4,35
  Bottom 0.5: IC2.2 15.2,34.62 15.2,34.6 | IC2.3 15.2,35.9 15.2,36 | 15.4,42.4 C1.- 15.4,40 15.2,39.8 | R1.1 55.4,38 54.05,38 Q6.2 53.85,37.85 53.8,37.8 54,37.6 v54,36.4 | R9.1 93,29.2 92.85,29.35 | R10.1 92.8,26.8 92.85,26.85 | R11.1 92.8,24.2 92.85,24.25
  Bottom 1: C5.2 15.2,39.8 C4.2 | 18.4,31.6 18.4,32 IC2.8 | C7.- 16.2,32
  Bottom 3: D5.A 18.4,32 16.2,32 15.2,32 15.2,34.6 15.2,36 15.2,39.8
  other vias: 62.2,38.8 72,38.8 67.8,38.6 59.2,38.6 61.2,27.4 88.2,54 94,54.6 94,52.6 88.2,52.6 65.4,54.8 65.4,53.2 57.4,54.8 57.4,53.2 93,23.2 40,20.6 40,16.6 47.2,16.6 47.2,20.6
  pour Top (isolate 0.4): 0,59.8 98.4,59.8 98.4,18.8 74.2,18.8 74.2,0 0,0
  pour Bottom (isolate 0.4): 0,59.8 98.4,59.8 98.4,18.8 74.2,18.8 74.2,0 0,0
ISEN-EN  (via drill 0.5)
  Top 0.2: v68,43.8 68.2,44 69.6,44 71.4,45.8 76,45.8 76.6,45.2 76.6,42.8 76,42.2 76,34.2 75.4,33.6 75.4,25.6 v76.2,24.8
  Bottom 0.2: R20.2 69,42.4 69,43.37 69.42,43.78 | 69.42,43.78 IC5.1 | U$9.44 | U$9.44 76,26.2 | 69.42,43.78 69.4,43.8 v68,43.8 | 69.42,43.78 | U$9.44 76.02,25.18 v76.2,24.8
ISEN-GSEL  (via drill 0.5)
  Top 0.2: v75.4,43.4 75.6,43.2 75.6,34.4 75,33.8 v75,24.2
  Bottom 0.2: R19.2 74.2,42.4 74.2,43.8 | IC5.10 74.2,43.82 74.2,43.8 | U$9.45 75.53,25.53 75,25 v75,24.2 | v75.4,43.4 74.6,43.4 74.2,43.8
ISEN-OUT  (via drill 0.5)
  Top 0.2: v73.6,33.6 73.4,33.4 73.4,44.4 73.8,44.8 v75.4,44.8
  Bottom 0.2: U$9.59 73.63,33.17 v73.6,33.6 | IC5.8 75,45.2 v75.4,44.8
L2
  Top 1: Q3.6 28.2,49 | Q3.6 Q3.5 | 27.6,49 Q3.6 | 27.6,49 Q3.7 Q3.8 | 27.6,49.8 27.6,49
  Top 2: U$3.P$1 14.19,49 21.8,49 D7.C 22.3,49.8 27.6,49.8
LED0  (via drill 0.5)
  Top 0.2: R5.1 91.8,39.8 v91.4,39.4
  Bottom 0.2: U$9.12 79.58,37.62 79.6,37.6 79.6,38.6 81.4,40.4 86.4,40.4 87,39.8 91,39.8 v91.4,39.4
LED1  (via drill 0.5)
  Top 0.2: v91.4,38.2 R6.1
  Bottom 0.2: U$9.13 80,37.6 80,38.4 81.6,40 86.2,40 86.8,39.4 89.8,39.4 91,38.2 v91.4,38.2
LED2  (via drill 0.5)
  Top 0.2: v91.4,36.6 R7.1
  Bottom 0.2: U$9.14 80.58,37.62 80.6,37.6 80.6,38.4 81.8,39.6 86,39.6 86.6,39 89.4,39 90.4,38 90.4,37.2 91,36.6 v91.4,36.6
LED3  (via drill 0.5)
  Top 0.2: v91.4,35 R8.1
  Bottom 0.2: U$9.15 81.02,36.58 81.2,36.4 82,36.4 82.6,37 84.8,37 86.4,38.6 89.2,38.6 90,37.8 90,35.8 90.8,35 91.2,35 | 91.2,35 91,35 | 91.2,35 v91.4,35
MOT-PWR-EN  (via drill 0.5)
  Top 0.2: v57,39.4 57.2,39.6 60.2,39.6 60.6,40 60.6,43.8 60.8,44 60.8,48.2 61.6,49 76.4,49 77,48.4 77,44.6 78.6,43 v78.6,35.8
  Bottom 0.2: R1.2 56.75,39.65 v57,39.4 | U$9.22 82.03,33.17 80.8,34.4 80.2,34.4 v78.6,35.8
  Bottom 0.5: R1.2 55.4,39.8 53.95,39.8 Q6.1
MSP2XBMUX  (via drill 0.6)
  Top 0.2: v82,25 77.8,20.8 77.8,12 85,4.8 85,2.6 85.17,2.43 | 85.17,2.43 85.2,2.4 | JP1.3 85.17,2.43
  Bottom 0.2: U$9.34 81.03,25.37 81.6,24.8 81.8,24.8 v82,25
N$1
  Top 0.2: R5.2 LED11.A
N$2
  Bottom 0.2: IC5.3 66.59,45.21 R28.2 65.4,46.8 65.6,46.6 | 61.2,54.2 U$4.P$2
  Bottom 2: U$4.P$2 65.6,49.2 65.6,46.6 | U$6.P$2 41.85,58.2 57.8,58.2 61.2,54.8 61.2,54.2
N$3
  Bottom 0.5: Q6.3 51.7,38.5 RL1.COIL1
N$4
  Top 0.2: R6.2 LED12.A
N$5
  Bottom 0.2: IC2.6 21.3,35.9 R30.1
  Bottom 1: Q2.1 Q2.2 Q2.3
  Bottom 2: Q2.1 24.8,36 22,36 R30.1
N$6
  Bottom 0.5: C5.1 11.8,39.8 11.8,37.63 IC2.4
N$7
  Bottom 0.2: 49,41.8 R21.1 C15.1
N$8
  Top 1: C17.1 29,31.2 27.37,31.2 IC4.4
N$9
  Bottom 0.2: U$9.8 77.53,41.33 85.6,49.4 87.4,49.4 | 87.4,49.4 87.4,49.37 Q7.2 87.33,49.33 87.4,49.4 | 84.8,46.8 Q9.2 84.98,46.78 85,46.8 | 85,46.8 86.6,48.4 86.6,48.6 87.4,49.4 | C20.2 85.2,46.6 85,46.8
N$10
  Bottom 0.2: IC2.7 19.98,34.62 20.2,34.4 25.8,34.4 27.4,36 27.4,39.2 26.8,39.8 24.8,39.8 Q2.4
N$11
  Top 0.2: R26.1 25.6,40.2 25.7,40.1 IC4.6
  Top 1: Q3.3 Q3.2 Q3.1
  Top 2: R26.1 25.8,40.8 25.8,43.7 Q3.1
N$12
  Top 1: C10.1 50.85,33.6 52.37,33.6 IC3.4
N$13
  Top 0.2: IC3.6 54.1,24.5 R25.1
  Top 1: Q1.1 54.06,21.2 52.8,21.2 52.8,21.19 Q1.2 52.79,21.2 51.7,21.2 Q1.3
  Top 2: R25.1 53.8,24 53.8,21.46 54.06,21.2
N$14
  Bottom 1: D4.GATE 41.51,49.11 41.6,49.2 | D4.SOURCE 46.07,49.13 46,49.2
  Bottom 2: 41.6,49.2 44.8,49.2 | 44.8,49.2 46,49.2 | U$6.P$1 44.75,49.25 44.8,49.2
N$15
  Top 0.2: IC3.7 55.6,26.76 55.6,22.6 56,22.2 56,21 54.4,19.4 50.6,19.4 50.4,19.6 50.4,21 50.34,21.06 Q1.4
N$16
  Top 0.2: R7.2 LED13.A
N$17  (via drill 0.5)
  Top 0.2: v57,40.8 57,41.8 60.4,45.2 60.4,48.4 61.4,49.4 76.6,49.4 77.4,48.6 77.4,44.8 82,40.2 88.6,40.2 89.8,39 89.8,34.6 90.4,34 93.2,34 | v54.2,41 53.4,40.2 46.2,40.2 37.8,48.6 RL1.NC | 93.2,34 93.4,34 | v95.2,33.8 95,34 93.2,34
  Bottom 0.2: C15.2 40.95,45.05 37.8,48.2 37.8,48.6 | v57,40.8 56.8,41 v54.2,41 | 97.05,41.75 R22.2 97,41.4 97,40.8 95.2,39 v95.2,33.8
  Bottom 2: RL1.NC 37.8,48.6 33.4,48.6 28.4,53.6 U$8.P$1 28.4,53.55 | U$11.P$1 8.2,39.95 8.2,55.4 11,58.2 26.2,58.2 28.4,56 28.4,53.55 | 28.4,53.55 28.4,53.4
N$18
  Bottom 0.2: 80.5,42.51 80.6,42.6 | 80.5,42.51 Q7.1 80.53,42.47 80.6,42.4 83.02,44.82 Q9.1 83,45 83,44.85 C21.2 | U$9.9 78.03,40.03 80.5,42.51
N$19
  Bottom 0.2: U$9.53 58.57,30.17 57.2,28.8 | 57.2,28.8 Q8.2 | C23.2 59.35,26.65 57.2,28.8
N$20
  Top 0.2: Q3.4 29.4,43.8 29.4,46 29,46.4 24.6,46.4 24,45.8 24,42.4 24.4,42 24.4,38 24.43,37.98 IC4.7
N$21
  Top 0.2: 94.4,35 R8.2 LED14.A
N$22
  Bottom 1: Q2.6 30,38.6 | Q2.6 Q2.5 | 30,38 Q2.6 | 30,38 Q2.7 Q2.8 | 30.8,38 30,38
  Bottom 2: U$1.P$1 30,23.4 30,31.6 28.8,31.6 28.8,32 D5.C 30.8,32 30.8,38
N$23
  Top 1: Q1.5 50.4,15.85 50.4,15.8 51.6,15.8 | Q1.8 54.04,15.8 53,15.8 | 51.6,15.8 52.4,15.8 | 52.4,15.8 53,15.8 | Q1.6 51.6,15.8 | Q1.7 52.99,15.8 53,15.8 | 52.4,15.8 52.4,15.2
  Top 2: U$2.P$1 66,16 58.4,16 58.2,16.2 D6.C | D6.C 58.2,17.6 | D6.C 58.2,15.2 52.4,15.2
N$25  (via drill 0.5)
  Top 0.2: v95.4,41.2 LED15.A
  Bottom 0.2: 95.6,41.4 R22.1 v95.4,41.2
N$26  (via drill 0.5)
  Top 0.2: C12.2 76.75,32.25 76.6,32.4 C11.2 76.95,32.35 77,32.4 v77,34.8
  Bottom 0.2: U$9.7 77.03,35.03 v77,34.8
N$27
  Top 0.2: R15.1 LED1.A
N$28
  Bottom 0.2: 79.53,25.87 U$9.37
N$29  (via drill 0.5)
  Top 0.2: IC3.3 54.1,34.51 55,35.4 55,37.6 53.2,39.4 48.2,39.4 45.8,37 v45.8,36.6
  Bottom 0.2: v45.8,36.6 44.8,36.6 43.2,35 43.2,34 Q4.3 43.1,33.5 42.6,33 42,33 41.8,33.2 R2.1
N$30  (via drill 0.5)
  Top 0.2: v95.6,46.2 LED8.A
  Bottom 0.2: R12.1 v95.6,46.2
N$31  (via drill 0.5)
  Top 0.2: LED9.A 95.4,44.8 96.4,44.8 96.4,50.6 95.4,51.6 94.4,51.6 v94,51.2
  Bottom 0.2: R4.1 94.6,49.4 94,50 v94,51.2
N$35
  Bottom 2: U$5.P$1 85.15,53.25 85.2,53.2 79.25,47.25 F1.1
N$36
  Top 0.2: R18.1 22.6,29.4 22.6,28.6 23,28.2 Q5.3 25,28.2 25.4,28.6 25.4,31.4 25.67,31.67 IC4.3
N$37  (via drill 0.5)
  Top 0.2: LED10.A v95.4,43.2
  Bottom 0.2: 95.6,43 R14.1 v95.4,43.2
N$39
  Bottom 0.2: IC5.2 63.89,44.71 63.4,45.2 63.4,46.2 62.8,46.8 R28.1
  Bottom 2: F1.2 R28.1
N$43  (via drill 0.6)
  Top 0.2: XB3.3 95.9,5.9 v93.4,8.4
  Bottom 0.2: v93.4,8.4 86.6,8.4 82.6,4.4 82.6,2.4 82.61,2.41 JP1.2
N$44
  Bottom 0.2: U$9.2 74.53,38.27 74.2,38.6 74.2,39.2 74,39.4 U$32.P$1
N$45
  Bottom 0.2: U$9.3 75.03,38.37 74.8,38.6 U$31.P$1
N$46
  Bottom 0.2: U$9.4 75.53,38.47 75.4,38.6 U$30.P$1
N$47
  Bottom 0.2: U$9.5 76.03,39.57 U$29.P$1
N$48
  Bottom 0.2: 76.8,39.4 U$28.P$1 76.8,39.2 76.53,38.93 U$9.6
N$49
  Bottom 0.2: U$9.28 84.43,30.17 85,29.6 85.6,29.6 85.9,29.3 U$13.P$1
N$50
  Bottom 0.2: U$9.24 84.97,32.17 85.4,32.6 U$37.P$1
N$51
  Bottom 0.2: 85.93,31.67 U$38.P$1 85.87,31.67 U$9.25
N$52
  Bottom 0.2: U$39.P$1 85.6,31 85.43,31.17 U$9.26
N$53
  Bottom 0.2: U$9.27 84.73,30.67 85.2,30.2 U$40.P$1
N$54
  Bottom 2: CON-CHGIN.1 90.63,54.77 87.4,58 73.2,58 68.8,53.6 U$4.P$1
N$55
  Bottom 0.2: U$9.47 74.53,25.33 74.2,25 U$27.P$1
N$56
  Bottom 0.2: IC5.7 74.51,45.71 74.8,46 74.8,47.8 74.6,48 R32.2
N$58
  Bottom 0.2: 71,48 R16.2 72.2,48 | IC5.6 72.79,46.21 72,47 72,47.8 72.2,48 | 72.2,48 R32.1
N$68
  Top 0.2: R27.1 LED2.A
N$70
  Bottom 0.2: U$9.52 67.67,29.67 66.8,28.8 | 66.8,28.8 Q8.1 | 66.8,28.8 65.6,28.8 64.05,27.25 C24.2
RST/NMI  (via drill 0.5)
  Top 0.2: 71.98,34.8 71.98,34.78 | 71.98,34.8 U$24.P$11 | C19.1 82.05,31.95 82,32 R3.2 82.05,32.55 81.8,32.8 80.8,32.8 80.4,33.2 v80.4,33.4 | 71.98,34.8 72,34.8 72,32.6 70.2,32.6 69.4,33.4 v69.4,33.6
  Bottom 0.2: v80.4,33.4 80.4,33 80.07,32.67 U$9.58 70.33,32.67 v69.4,33.6
RTS  (via drill 0.5)
  Top 0.2: XB3.16 76.5,9.9 77.2,10.6 77.2,21.2 78,22 v78,28.8
  Bottom 0.2: U$9.49 75.4,28.17 75.4,28.2 76,28.8 v78,28.8
RX
  Bottom 0.2: U$9.33 82.38,26.22 83,25.6 83,25 U$17.P$1
SCL  (via drill 0.5)
  Top 0.2: v84.8,21.4 v84.8,26.4 | CON-SLUG.2 13.4,7.15 13.4,7.2 21,7.2 22.8,9 22.79,9 CON1.4
  Bottom 0.2: CON4.4 64.67,9.27 65.6,10.2 71.2,10.2 72,11 72,20.4 73,21.4 79.6,21.4 80.8,22.6 82.4,22.6 83.6,21.4 v84.8,21.4 | U$9.31 84.33,28.67 84.8,28.2 v84.8,26.4
  Bottom 0.406: R34.1 16.8,8.4 15.6,7.2 13.8,7.2 13.6,7 13.47,7.13 CON-SLUG.2
  Bottom 0.5: CON2.4 36.77,8.97 36.8,9 36,9.8 | 36,9.8 26.4,9.8 25.8,10.4 24.8,10.4 24.4,10 23.79,10 22.79,9 22.73,9 | 36,9.8 38,9.8 38.4,10.2 38.8,10.2 39,10.4 39.8,10.4 40,10.2 40.2,10.2 40.6,9.8 49.8,9.8 50.62,8.97 CON3.4 51.73,10 52.4,10 52.8,10.4 53.6,10.4 55,9 64.64,9 CON4.4 | 22.73,9 22.6,9 | CON1.4 22.73,9
SDA  (via drill 0.5)
  Top 0.2: v81.8,29 83.2,27.6 83.2,23.6 81.8,22.2 v81.8,21.4
  Bottom 0.2: CON4.2 70.58,8.97 72.4,10.8 72.4,20.2 73.2,21 81.8,21 v81.8,21.4 | 25.6,7.8 19.6,7.8 18.4,9 17.8,9.6 13.4,9.6 13.4,9.65 CON-SLUG.3 | U$9.29 82.47,29.67 v81.8,29
  Bottom 0.406: R33.1 18.17,8.77 18.4,9
  Bottom 0.5: CON4.2 67.21,7.8 53.2,7.8 | CON3.2 53.24,9 53.2,9 53.2,7.8 | 39.4,8.97 39.4,9 | 39.4,8.97 CON2.2 | 39.4,7.8 53.2,7.8 | 39.4,7.8 39.4,8.97 | 25.4,8.97 25.4,9 | 25.4,8.97 CON1.2 | 39.4,7.8 25.6,7.8 25.4,7.8 25.4,8.97
SERVO-PWR-EN  (via drill 0.5)
  Top 0.2: Q5.1 26.75,27.25 26.8,27.2 26.95,27.35 R13.2 28.2,27.2 29,26.4 32.8,26.4 33.8,25.4 36.6,25.4 38.2,23.8 v38.4,23.8 | v79.8,24.6 80,24.6 80.6,25.2 80.6,29.4 81.2,30 83,30 83.2,30.2 83.2,32.6 v80.6,35.2
  Bottom 0.2: U$9.21 82.13,33.67 v80.6,35.2 | v79.8,24.6 79.8,24.4 79.6,24.2 79.6,23.8 79,23.2 38.8,23.2 38.4,23.6 v38.4,23.8
SLUG2XB  (via drill 0.5)
  Top 0.2: v35.8,16.8 35.6,16.8 35,17.4 20.4,17.4 17.8,14.8 13.4,14.8 13.42,14.78 CON-SLUG.5
  Bottom 0.2: v35.8,16.8 35.8,22 36.2,22.4 79.4,22.4 80.6,23.6 84.6,23.6 87.4,20.8 87.4,11.6 83.6,7.8 81.8,7.8 80.07,6.07 JP1.1
SLUG-BOOT  (via drill 0.5)
  Top 0.2: v34,23.6 20.6,23.6 v18.6,21.6
  Bottom 0.2: U$9.51 70.97,29.17 70.6,28.8 70.6,24.4 69.8,23.6 40.2,23.6 39.2,24.6 35,24.6 v34,23.6 | v18.6,21.6 14.4,17.4 13.4,17.4 13.4,17.31 CON-SLUG.6
SLUG-PWR-EN  (via drill 0.5)
  Top 0.2: v37.4,21.4 37.4,23.8 36.4,24.8 32.8,24.8 v32.2,25.4 | v83.8,22.6 83.8,33.6 82.2,35.2 v82,35.2
  Bottom 0.2: R17.2 46.6,34.8 45.45,34.8 Q4.1 44.2,33.85 44.2,33.2 42.4,31.4 35.2,31.4 32.2,28.4 v32.2,25.4 | v37.4,21.4 38,22 79.6,22 80.8,23.2 83.2,23.2 v83.8,22.6 | U$9.20 82.63,34.17 82,34.8 v82,35.2
SOMI
  Bottom 0.2: U$14.P$1 85.7,28.5 85.6,28.4 84.83,29.17 U$9.30
START  (via drill 0.5)
  Top 0.2: v85.4,33.6 85.4,36.6 86.2,37.4 86.2,38.67 U$10.P$2
  Bottom 0.2: U$9.23 84.27,32.67 v85.4,33.6 R31.2
SW0  (via drill 0.5)
  Top 0.2: v84.4,38.2 84.4,28.8 S1.8
  Bottom 0.2: U$9.16 81.55,37.6 83.8,37.6 v84.4,38.2
  Bottom 0.5: S1.8 R11.2
SW1  (via drill 0.5)
  Top 0.2: v86.6,36.4 86.6,29.2 89,26.8 88.99,26.79 S1.7
  Bottom 0.2: U$9.17 85.87,35.67 v86.6,36.4
  Bottom 0.5: S1.7 88.99,26.79 89,26.8 R10.2
SW2  (via drill 0.5)
  Top 0.2: v87.6,35.6 87.2,35.2 87.2,30.4 88.2,29.4 89,29.4 88.99,29.39 S1.6
  Bottom 0.2: U$9.18 87.17,35.17 v87.6,35.6 | S1.6 88.99,29.21 89,29.2 89.2,29.2
  Bottom 0.5: S1.6 88.99,29.39 | 89.2,29.2 R9.2
SW3  (via drill 0.5)
  Top 0.2: 88.99,34.41 S1.5 | 88.99,34.41 89,34.4 | v88.6,36.4 88.6,34.8 88.99,34.41
  Bottom 0.2: U$9.19 88.47,34.67 88.6,34.8 v88.6,36.4
  Bottom 0.5: S1.5 R29.2
TCK  (via drill 0.5)
  Top 0.2: U$24.P$7 66.86,36.26 66.8,36.2 v66.8,34.2
  Bottom 0.2: U$9.57 68.83,32.17 v66.8,34.2
TDI/TCLK  (via drill 0.5)
  Top 0.2: U$24.P$3 61.82,36.22 61.8,36.2 v61.8,34.2
  Bottom 0.2: U$9.55 64.83,31.17 v61.8,34.2
TDO/TDI  (via drill 0.5)
  Top 0.2: U$24.P$1 59.26,36.26 59.2,36.2 v59.2,34.2
  Bottom 0.2: U$9.54 62.73,30.67 v59.2,34.2
TMS  (via drill 0.5)
  Top 0.2: U$24.P$5 64.36,36.24 64.4,36.2 v64.4,34.2
  Bottom 0.2: U$9.56 66.93,31.67 v64.4,34.2
TX
  Bottom 0.2: U$9.32 83.45,28.2 83.4,28.2 83.4,27.9 U$16.P$1
VLOGICRAW  (via drill 0.5, 0.6)
  Top 0.2: C16.1 29,37.6 29.4,37.6 | v34,40.4 34,41 v34,41.6 | 74.2,50.2 61,50.2 59.6,48.8 59.6,45.6 55.4,41.4 55.4,34.8 | 74.2,50.2 89,50.2 89.6,49.6 91.6,49.6 91.8,49.4 91.8,48.8 92.8,47.8 R27.2 | IC3.2 55.38,33.17 55.4,33.2 55.4,34.8 | 37.2,29 36.4,28.2 31,28.2 29.8,29.4 29.8,32 28.2,32 28,32.2 28,32.8 27.8,33 25.2,33 25,32.8 25,32.24 IC4.2 24.43,31.02 24.4,31 24.4,29.55 R18.2 | 74.2,50.2 74.2,51.6 v74,51.8 | v56,35.2 55.4,34.8 | v35.2,41.6 35,41.4 35,41 35.2,40.8 v35.2,40.4 | v36.4,40.4 36.8,40.8 36.8,41 36.8,41.2 v36.4,41.6
  Top 0.5: 29,38.8 28.97,38.8 27.88,38.8 IC4.5 | C9.1 50.8,26.4 50.8,26 51.85,26 IC3.5
  Top 1: C16.1 28.97,38.8 28.97,39.77 30,40.8 R26.2 | C9.1 50.88,25.08 49.8,24 R25.2
  Top 2: R26.2 31.8,41.2 32,41 34,41 35,41 | R25.2 42.8,24 42.8,30 42.6,30.2 | 35,41 35.4,41 | 35,41 36.8,41 | 35,41 35,34.8 38.2,31.6 C6.+ | C6.+ 38.2,30 37.2,29 | 42.6,30.2 C2.+ | C6.+ 42.6,30.2
  Bottom 0.2: 33.6,41 34,40.6 v34,40.4 | IC5.9 72.69,44.71 70.2,47.2 70.2,48.8 70.6,49.2 73.4,49.2 74.05,49.85 R23.2 74,50.2 v74,51.8 | D4.DRAIN 43.8,41 | D4.DRAIN 43.79,40.81 43.8,40.8 | D4.DRAIN 43.8,40.8 | 43.8,40.8 43.8,36.85 41.95,35 41.6,35 R2.2 | v56,35.2 51.2,35.2 50.6,34.6 48.8,34.6 47.8,35.6 47.8,36.8 43.8,40.8
  Bottom 0.5: IC2.5 19.6,38.35 19.6,39.8
  Bottom 1: C4.1 19.6,39.8 21,39.8 21.6,40.4 R30.2
  Bottom 2: 21.6,44.2 R30.2 | 21.6,44.2 21.6,47.6 21.4,47.8 | D4.DRAIN 43.69,41 36.8,41 | 33.6,41 36.8,41 | 21.4,47.8 21,48.2 C1.+ | 21.4,47.8 22,48.4 | 21.6,44.2 33.6,44.2 36.8,41
VRAW
  Top 0.2: U$4.P$3 53.8,53.6 56.8,50.6 72.6,50.6 73,51 73,52.4 73.4,52.8 74.6,52.8 75,52.4 75,51 75.2,50.6 89.2,50.6 89.8,50 92.2,50 92.8,49.4 R15.2
  Bottom 0.2: R21.2 50.35,40.15 52,41.8 RL1.C
  Bottom 2: U$4.P$3 53.7,44.3 53.5,44.3 RL1.C
VREG3.3  (via drill 0.5)
  Top 0.2: 79.2,32.4 C18.1 | R3.1 79.6,32 79.2,32.4 | 79.2,32.4 79.2,32.6 78.6,33.2 v78.6,34.2 79.6,35.2 79.6,36.2 79.4,36.4 79.4,37.4 80.67,38.67 U$10.P$4 | S1.1 94,21.6 94,11.8 93.65,11.45 C22.1 92.95,11.45 92.8,11.6 92,10.8 92,8.2 93,7.2 93.6,7.2 94.2,6.6 94.2,3.6 95.9,1.9 XB3.1
  Top 0.5: 61.8,41.34 61.8,41.2 | 61.8,41.34 U$24.P$4 | v61.8,43.4 61.8,41.34
  Bottom 0.2: U$9.1 74.03,35.8 74.03,35.57 73.93,35.67 | U$9.64 72.08,35.72 72,35.8 | v78.6,34.2 78,34.8 78,35 77.6,35.4 77.6,36.4 77.8,36.6 78.2,36.6 78.53,36.93 U$9.10 78.53,38.73 80.6,40.8 86.6,40.8 87.2,40.2 92.8,40.2 | S1.4 97.6,32.8 97.6,40.4 98,40.8 98,45.6 97.4,46.2 R12.2 | 92.8,40.2 93.8,40.2 | 92.8,40.2 94,39 94,32 94.2,31.8 S1.4
  Bottom 0.406: 18.17,10.57 18.2,10.6 | 18.17,10.57 R33.2 19.45,10.45 22.6,13.6 26.57,13.6 26.6,13.6 | R34.2 18.05,10.45 18.17,10.57
  Bottom 0.5: IC2.1 12.27,29.93 15.2,27 19.6,27 22.6,24 | S1.2 S1.1 | S1.2 96.61,26.79 96.6,26.8 | S1.2 96.61,29.01 96.8,29.2 96.73,29.27 S1.3 96.61,31.79 S1.4 | v78.6,34.2 78,33.8 75.4,33.8 74,35.2 74,35.8 74.03,35.8 72,35.8 65.6,35.8 64.2,37.2 64.2,39.2 63.6,39.8 61.4,39.8 | 58.6,14.6 57.8,14.6 | 50.4,14.6 50.4,14.4 | 32.2,14.6 32.2,14.4 | 32.6,14.6 32.6,24 33.6,25 33.6,29 35.4,30.8 57.2,30.8 57.8,31.4 57.8,35.2 61,38.4 61,39.4 61.4,39.8 | 63,43.4 v61.8,43.4 61.8,40.2 61.4,39.8
  Bottom 1: CON1.1 26.57,13.6 26.57,14.37 26.8,14.6 | 40.6,14.6 40.6,14.8 40.54,14.74 CON2.1 | CON3.1 54.51,14.6 54.6,14.6 | 65.8,14.6 65.8,14.8 66,15 68.48,12.52 CON4.1
  Bottom 2: C7.+ 22.6,24 23.2,24 U$1.P$2 23.2,17.8 26.4,14.6 26.8,14.6 32.2,14.6 32.6,14.6 40.6,14.6 50.4,14.6 54.6,14.6 58.6,14.6 65.8,14.6
VREGSLUG5  (via drill 0.5)
  Top 0.2: IC3.1 56.65,34.45 57,34.8 57,35.6 55.8,36.8 55.8,41.2 60,45.4 60,48.6 61.2,49.8 88.8,49.8 89.8,48.8 v91,48.8
  Top 0.5: IC3.1 60.87,33.13 63,31 63,26.4 66,23.4
  Top 1: 23.2,18.4 54.6,18.4 58,21.8 65.8,21.8 66,22 66,22.8
  Top 1.016: 23.2,18.4 20.6,18.4 19.2,19.8 13.4,19.8 | 13.4,19.8 13.4,19.81 CON-SLUG.7 | USBPOWER.P$1 5.4,20.8 12.4,20.8 13.4,19.8
  Top 2: C3.+ 66,23.4 66,22.8 U$2.P$2
  Bottom 0.2: R4.2 92,49.4 91.4,48.8 v91,48.8
XB2SLUG+MSP  (via drill 0.5)
  Top 0.2: v34,16.4 22,16.4 18,12.4 13.6,12.4 CON-SLUG.4 | CON-SLUG.4 13.4,12.2 | CON-SLUG.4
  Bottom 0.2: U$9.35 80.53,25.27 81.8,24 | 81.8,24 84.8,24 87.8,21 87.8,11.8 90.2,9.4 94,9.4 94.4,9 94.4,4.2 94.8,3.8 96.2,3.8 XB3.2 | 81.8,24 80.4,24 79.2,22.8 35,22.8 34.4,22.2 34.4,16.8 v34,16.4
XB-SLEEP
  Bottom 0.2: XB3.9 92.1,17.9 82,28 81,28 79.2,29.8 74.4,29.8 73.27,28.67 U$9.50

### Text on the board
Top: Power Board
Bottom: www.studentrobotics.org | REV8.4
tPlace: U$4 | U$7 | U$8 | U$6 | U$5 | U$11 | USBPOWER